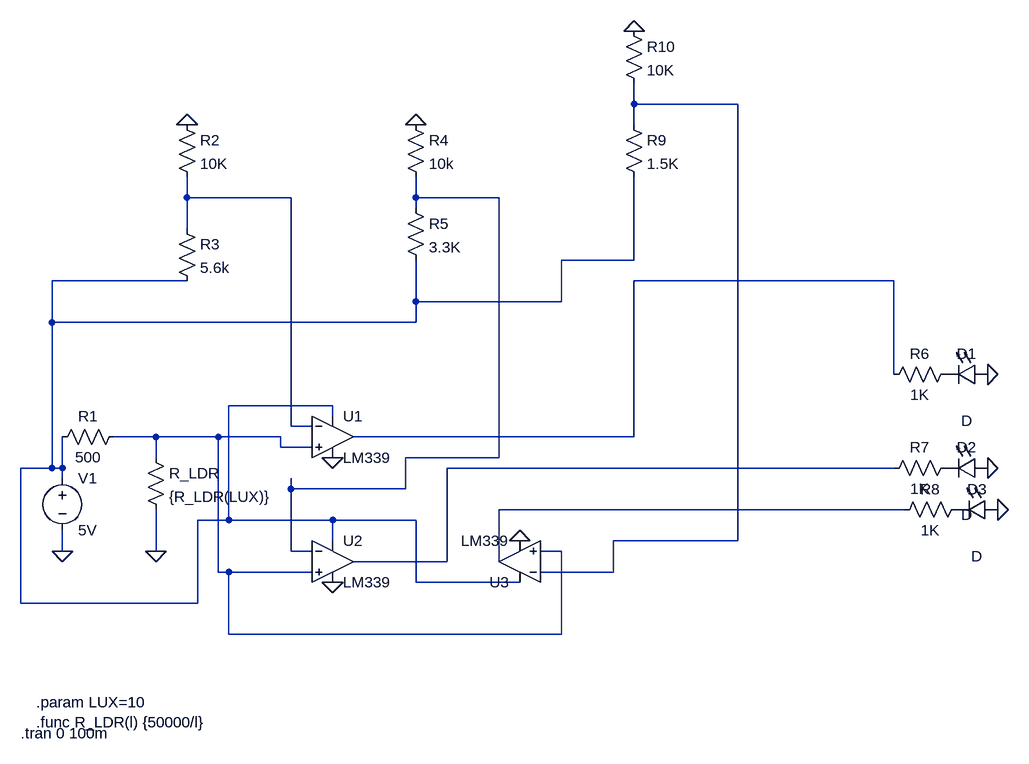
[diagram p0: schematic Sensor AGUA LTSPICE.asc]
Sensor AGUA LTSPICE.asc, the LTspice schematic file:
Version 4.1
SHEET 1 1680 680
WIRE 896 -448 896 -480
WIRE 1056 -448 896 -448
WIRE 896 -416 896 -448
WIRE 208 -304 208 -336
WIRE 368 -304 208 -304
WIRE 560 -304 560 -336
WIRE 688 -304 560 -304
WIRE 560 -288 560 -304
WIRE 208 -256 208 -304
WIRE 896 -208 896 -336
WIRE 896 -208 784 -208
WIRE 208 -176 0 -176
WIRE 1296 -176 896 -176
WIRE 560 -144 560 -208
WIRE 784 -144 784 -208
WIRE 784 -144 560 -144
WIRE 0 -112 0 -176
WIRE 560 -112 560 -144
WIRE 560 -112 0 -112
WIRE 1296 -32 1296 -176
WIRE 432 16 272 16
WIRE 432 32 432 16
WIRE 368 48 368 -304
WIRE 400 48 368 48
WIRE 160 64 96 64
WIRE 256 64 160 64
WIRE 352 64 256 64
WIRE 896 64 896 -176
WIRE 896 64 464 64
WIRE 352 80 352 64
WIRE 400 80 352 80
WIRE 160 96 160 64
WIRE 688 96 688 -304
WIRE 688 96 544 96
WIRE 0 112 0 -112
WIRE 0 112 -48 112
WIRE 16 112 16 64
WIRE 16 112 0 112
WIRE 1296 112 608 112
WIRE 16 128 16 112
WIRE 368 144 368 128
WIRE 544 144 544 96
WIRE 544 144 368 144
WIRE 1312 176 688 176
WIRE 272 192 272 16
WIRE 272 192 224 192
WIRE 432 192 272 192
WIRE 560 192 432 192
WIRE 432 224 432 192
WIRE 1056 224 1056 -448
WIRE 1056 224 864 224
WIRE 16 240 16 208
WIRE 160 240 160 176
WIRE 368 240 368 144
WIRE 400 240 368 240
WIRE 784 240 752 240
WIRE 608 256 608 112
WIRE 608 256 464 256
WIRE 688 256 688 176
WIRE 256 272 256 64
WIRE 272 272 256 272
WIRE 400 272 272 272
WIRE 864 272 864 224
WIRE 864 272 752 272
WIRE 560 288 560 192
WIRE 720 288 560 288
WIRE -48 320 -48 112
WIRE 224 320 224 192
WIRE 224 320 -48 320
WIRE 272 368 272 272
WIRE 784 368 784 240
WIRE 784 368 272 368
FLAG 16 240 0
FLAG 160 240 0
FLAG 432 96 0
FLAG 432 288 0
FLAG 720 224 0
FLAG 1440 -32 0
FLAG 1440 112 0
FLAG 1456 176 0
FLAG 208 -416 0
FLAG 560 -416 0
FLAG 896 -560 0
SYMBOL voltage 16 112 R0
SYMATTR InstName V1
SYMATTR Value 5V
SYMBOL res 112 48 R90
WINDOW 0 0 56 VBottom 2
WINDOW 3 32 56 VTop 2
SYMATTR InstName R1
SYMATTR Value 500
SYMBOL res 144 80 R0
SYMATTR InstName R_LDR
SYMATTR Value {R_LDR(LUX)}
SYMBOL res 1392 -48 R90
WINDOW 0 0 56 VBottom 2
WINDOW 3 32 56 VTop 2
SYMATTR InstName R6
SYMATTR Value 1K
SYMBOL res 1392 96 R90
WINDOW 0 0 56 VBottom 2
WINDOW 3 32 56 VTop 2
SYMATTR InstName R7
SYMATTR Value 1K
SYMBOL res 1408 160 R90
WINDOW 0 0 56 VBottom 2
WINDOW 3 32 56 VTop 2
SYMATTR InstName R8
SYMATTR Value 1K
SYMBOL LED 1440 -48 R90
WINDOW 0 0 32 VBottom 2
WINDOW 3 72 32 VTop 2
SYMATTR InstName D1
SYMBOL LED 1440 96 R90
WINDOW 0 0 32 VBottom 2
WINDOW 3 72 32 VTop 2
SYMATTR InstName D2
SYMBOL LED 1456 160 R90
WINDOW 0 0 32 VBottom 2
WINDOW 3 72 32 VTop 2
SYMATTR InstName D3
SYMBOL res 192 -432 R0
SYMATTR InstName R2
SYMATTR Value 10K
SYMBOL res 192 -272 R0
SYMATTR InstName R3
SYMATTR Value 5.6k
SYMBOL res 544 -432 R0
SYMATTR InstName R4
SYMATTR Value 10k
SYMBOL res 544 -304 R0
SYMATTR InstName R5
SYMATTR Value 3.3K
SYMBOL res 880 -432 R0
SYMATTR InstName R9
SYMATTR Value 1.5K
SYMBOL res 880 -576 R0
SYMATTR InstName R10
SYMATTR Value 10K
SYMBOL LM339 432 0 R0
SYMATTR InstName U1
SYMBOL LM339 432 192 R0
SYMATTR InstName U2
SYMBOL LM339 720 320 R180
SYMATTR InstName U3
TEXT -24 472 Left 2 !.param LUX=10\n.func R_LDR(l) {50000/l}
TEXT -48 520 Left 2 !.tran 0 100m

The netlist it stands for:
* Sensor AGUA LTSPICE.asc
V1 N004 0 5V
R1 N006 N004 500
R_LDR N006 0 {R_LDR(LUX)}
R6 P001 N005 1K
R7 P002 N007 1K
R8 P003 N008 1K
D1 0 P001 D
D2 0 P002 D
D3 0 P003 D
R2 0 N002 10K
R3 N002 N004 5.6k
R4 0 N003 10k
R5 N003 N004 3.3K
R9 N001 N004 1.5K
R10 0 N001 10K
X§U1 N006 N002 N004 0 N005 LM339  ; pins In+ In- V+ V- OUT
X§U2 N006 N003 N004 0 N007 LM339  ; pins In+ In- V+ V- OUT
X§U3 N006 N001 N004 0 N008 LM339  ; pins In+ In- V+ V- OUT
.model D D
.lib standard.dio
.param LUX=10
.func R_LDR(l) {50000/l}
.tran 0 100m
.lib LM339.sub
.backanno
.end